# EAGLE design SparkFun RTK Facet - External Connector (EAGLE 9.6.2)
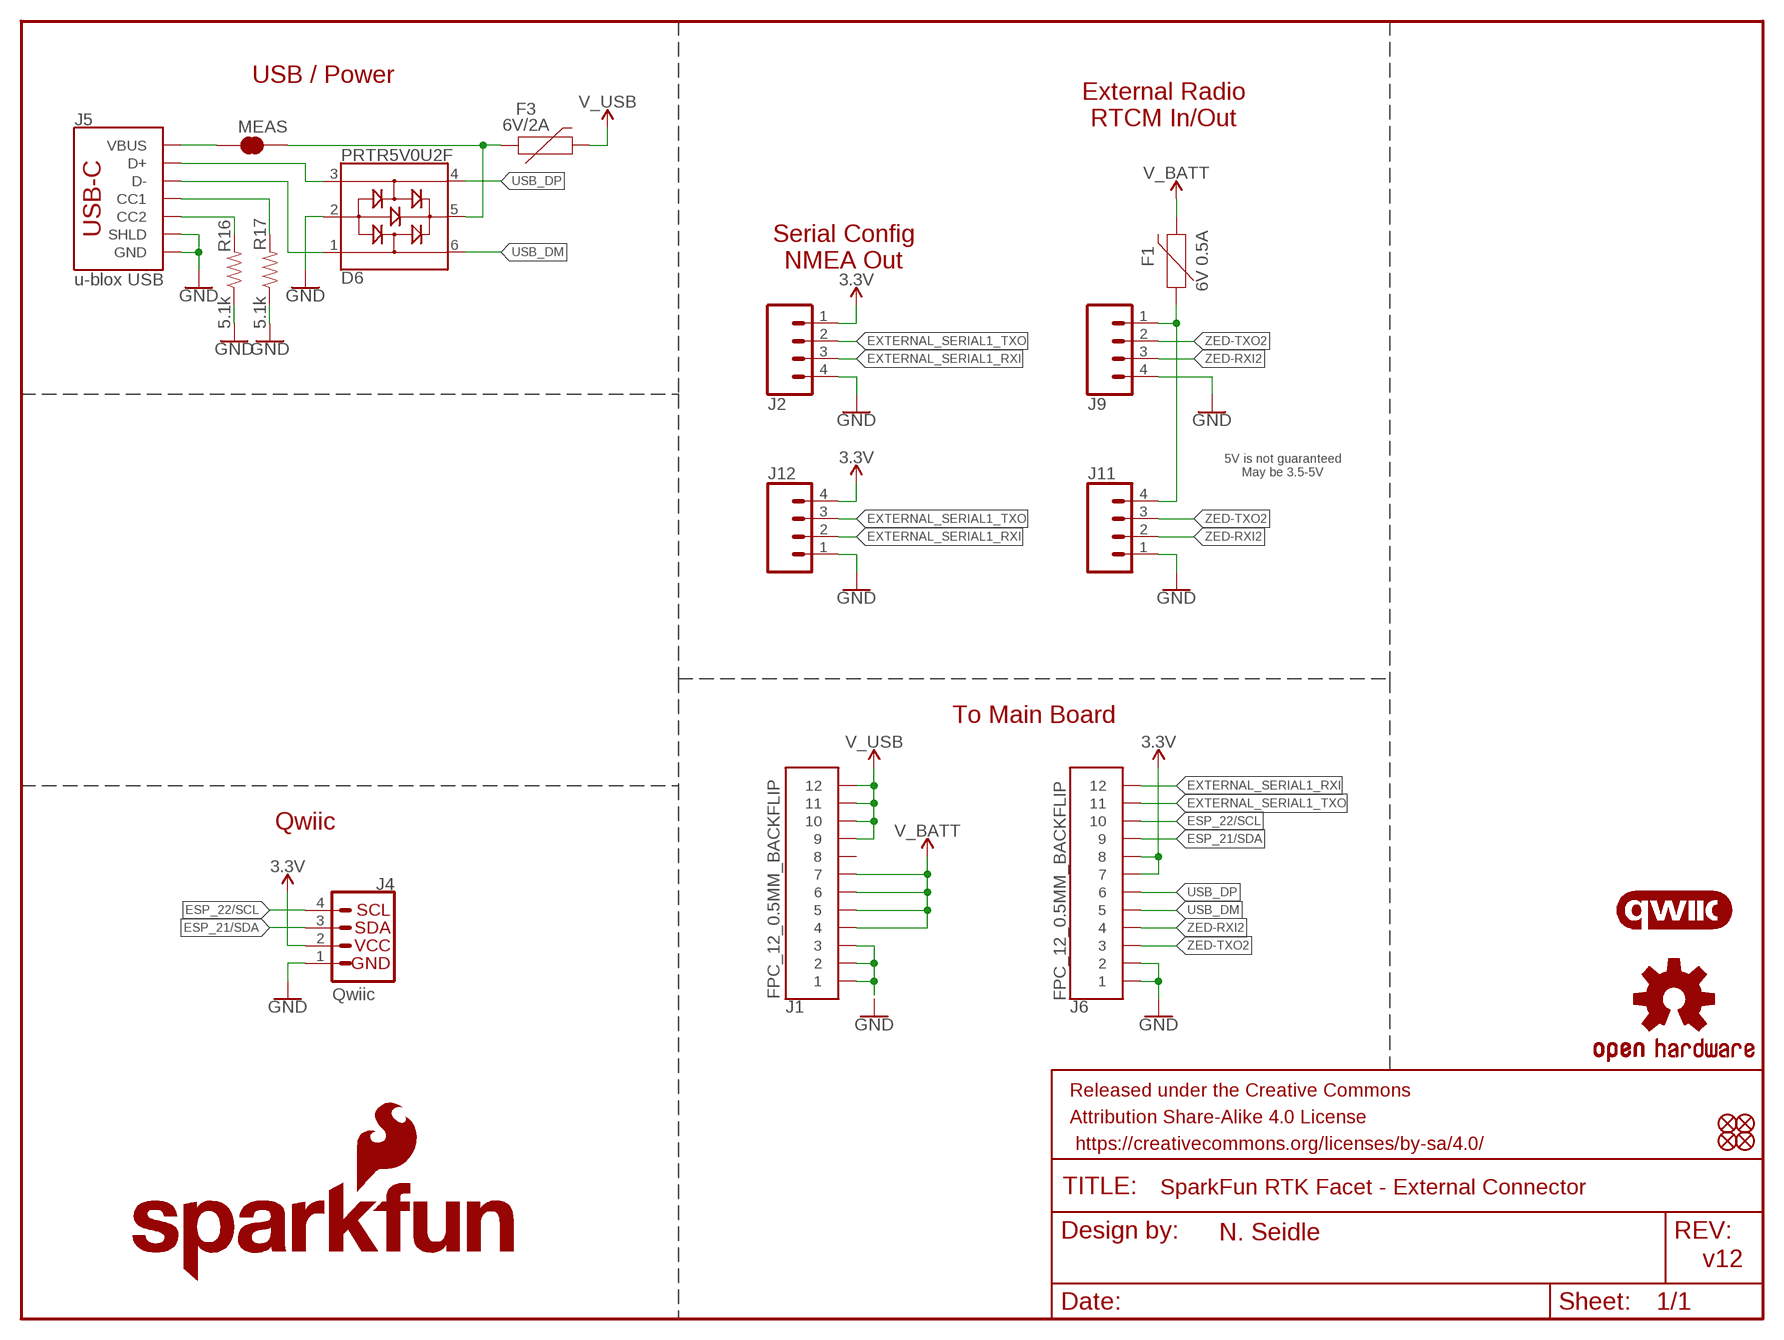
[diagram p0: schematic, sheet 1]

## Parts
D6  PRTR5V0U2F  [SOT886]
F1  6V 0.5A  PPTC_6V500MA  [0805]
F3  6V/2A  PPTC_6V2A  [1210]
FRAME1  FRAME-LETTER  [CREATIVE_COMMONS]
J1  FPC_12_0.5MM_BACKFLIP  [FPC_12_DOUBLESIDED_BACKFLIP]
J2  CONN_04JST-SMD-LOCKING  [JST-4-SMD-1.25MM-LOCKING]
J4  Qwiic  I2C_STANDARDQWIIC  [JST04_1MM_RA]
J5  u-blox USB  USB_C_2-LAYER_PADS  [USB-C-16P-2LAYER-PADS]
J6  FPC_12_0.5MM_BACKFLIP  [FPC_12_DOUBLESIDED_BACKFLIP]
J9  CONN_04JST-SMD-LOCKING  [JST-4-SMD-1.25MM-LOCKING]
J11  CONN_041X04_NO_SILK_NO_POP  [1X04_NO_SILK]
J12  CONN_041X04_NO_SILK_NO_POP  [1X04_NO_SILK]
JP21  FIDUCIALUFIDUCIAL  [FIDUCIAL-MICRO]
JP61  FIDUCIALUFIDUCIAL  [FIDUCIAL-MICRO]
JP71  FIDUCIALUFIDUCIAL  [FIDUCIAL-MICRO]
JP81  FIDUCIALUFIDUCIAL  [FIDUCIAL-MICRO]
LOGO1  OSHW-LOGOMINI  [OSHW-LOGO-MINI]
LOGO2  SFE_LOGO_NAME_FLAME.1_INCH  [SFE_LOGO_NAME_FLAME_.1]
LOGO3  QWIIC_LOGO_CONNECTOR  [QWIIC_5.5MM]
MEAS  JUMPER-COMBO_2_NC_TRACE  [COMBO-JUMPER_2_NC_TRACE]
R16  5.1k  5.1KOHM5.1KOHM-0603-1/10W-1%  [0603]
R17  5.1k  5.1KOHM5.1KOHM-0603-1/10W-1%  [0603]

## Nets
3.3V [power]: J2.1 J4.2 J6.7 J6.8 J12.4
CC1: J5.A5(CC1) R17.2
CC2: J5.B5(CC2) R16.2
ESP_21/SDA: J4.3 J6.9
ESP_22/SCL: J4.4 J6.10
EXTERNAL_SERIAL1_RXI: J2.3 J6.12 J12.2
EXTERNAL_SERIAL1_TXO: J2.2 J6.11 J12.3
GND: D6.2 J1.1 J1.2 J1.3 J2.4 J4.1 J5.GND J5.GND2(GND) J5.SHLD1(SHLD) J5.SHLD2(SHLD) J5.SHLD3(SHLD) J5.SHLD4(SHLD) J6.1 J6.2 J9.4 J11.1 J12.1 R16.1 R17.1
N$3 [power]: F1.1 J9.1 J11.4
USB1_D_M: D6.1 J5.A7(D-) J5.B7(D-)
USB1_D_P: D6.3 J5.A6(D+) J5.B6(D+)
USB_DM: D6.6 J6.5
USB_DP: D6.4 J6.6
V_BATT [power]: F1.2 J1.4 J1.5 J1.6 J1.7
V_USB [power]: F3.2 J1.9 J1.10 J1.11 J1.12
VIN [power]: J5.VBUS1(VBUS) J5.VBUS2(VBUS) MEAS.1 MEAS.3
VIN1 [power]: D6.5 F3.1 MEAS.2 MEAS.4
ZED-RXI2: J6.4 J9.3 J11.2
ZED-TXO2: J6.3 J9.2 J11.3
Unconnected: J1.8

## Notes on the sheet
- USB / Power
- External Radio
  RTCM In/Out
- Serial Config
  NMEA Out
- 5V is not guaranteed
  May be 3.5-5V
- To Main Board
- Qwiic
- N. Seidle
- v12

## Library data of the parts
D6 = SparkFun-IC-Power:PRTR5V0U2: A small ESD protection device. Most commonly used on USB D+/D- signals to protect large, expensive, or especially sensitive USB enabled devices.; PROD_ID: DIO-14084
F1 = SparkFun-Fuses:PPTC: Resettable Fuse PPTC Resettable Fuse. Really a sort of resistor with a polymeric positive temperature coefficient whose resistance increases dramatically with an increase in temperature. When heated by the power passing through the resistance rises causing the current to be limited, protecting the circuit. This is achieved by the transition of the polymer from a crystalline to an amorphous state where the conductive carbon separates breaking the conductive pathways found in the cool crystalline structure. When a PPTC cools back down it resumes conducting letting the circuit turn back on. SparkFun Products: SparkFun RedBoard - Programmed with Arduino <https://www.sparkfun.com/products/12757> Pro Micro - 5V/16MHz <https://www.sparkfun.com/products/12640> Arduino Pro 328 - 5V/16MHz <https://www.sparkfun.com/products/10915> MP3 Trigger <https://www.sparkfun.com/products/13720>; PROD_ID: RES-13945
F3 = SparkFun-Fuses:PPTC: Resettable Fuse PPTC Resettable Fuse. Really a sort of resistor with a polymeric positive temperature coefficient whose resistance increases dramatically with an increase in temperature. When heated by the power passing through the resistance rises causing the current to be limited, protecting the circuit. This is achieved by the transition of the polymer from a crystalline to an amorphous state where the conductive carbon separates breaking the conductive pathways found in the cool crystalline structure. When a PPTC cools back down it resumes conducting letting the circuit turn back on. SparkFun Products: SparkFun RedBoard - Programmed with Arduino <https://www.sparkfun.com/products/12757> Pro Micro - 5V/16MHz <https://www.sparkfun.com/products/12640> Arduino Pro 328 - 5V/16MHz <https://www.sparkfun.com/products/10915> MP3 Trigger <https://www.sparkfun.com/products/13720>; PROD_ID: RES-14313
FRAME1 = SparkFun-Aesthetics:FRAME-LETTER: Schematic Frame - Letter Standard 8.5x11 US Letter frame
J1 J6 = RTK Facet:FPC_12_0.5MM; PROD_ID: CONN-15766
J2 J9 = SparkFun-Connectors:CONN_04: Multi connection point. Often used as Generic Header-pin footprint for 0.1 inch spaced/style header connections On any of the 0.1 inch spaced packages, you can populate with these: Break Away Headers - Straight <https://www.sparkfun.com/products/116> (PRT-00116) Break Away Male Headers - Right Angle <https://www.sparkfun.com/products/553> (PRT-00553) Female Headers <https://www.sparkfun.com/products/115> (PRT-00115) Break Away Headers - Machine Pin <https://www.sparkfun.com/products/117> (PRT-00117) Break Away Female Headers - Swiss Machine Pin <https://www.sparkfun.com/products/743> (PRT-00743) For SCREWTERMINALS and SPRING TERMINALS visit here: Screw Terimnals on SparkFun.com <https://www.sparkfun.com/search/results?term=Screw+Terminals> (5mm/3.5mm/2.54mm spacing) This device is also useful as a general connection point to wire up your design to another part of your project. Our various solder wires solder well into these plated through hole pads. Hook-Up Wire - Assortment (Stranded, 22 AWG) <https://www.sparkfun.com/products/11375> (PRT-11375) Hook-Up Wire - Assortment (Solid Core, 22 AWG) <https://www.sparkfun.com/products/11367> (PRT-11367) View the entire wire category on our website here <https://www.sparkfun.com/categories/141> Special notes: Molex polarized connector foot print use with SKU : PRT-08231 with associated crimp pins and housings. 1MM SMD Version SKU: PRT-10208; PROD_ID: CONN-15303
J4 = SparkFun-Connectors:I2C_STANDARD: SparkFun I2C Standard Pinout Header SparkFun has standardized on a pinout for all I2C based sensor breakouts. This pinout allows I2C boards to be plugged directly into the headers on Arduino Uno compatible boards, and to be daisy chained easily. Example SparkFun Products: SparkFun Atmospheric Sensor Breakout - BME280 <https://www.sparkfun.com/products/13676> SparkFun Altitude/Pressure Sensor Breakout - MPL3115A2 <https://www.sparkfun.com/products/11084> SparkFun TOF Range Finder Sensor - VL6180 <https://www.sparkfun.com/products/12785>; PROD_ID: CONN-13694; VALUE: Qwiic Right Angle
J5 = SparkFun-Connectors:USB_C: USB Type C 16Pin Connector Super Speed pins not available on the 16-pin purely SMD connector so this part is best for USB 2.0 implementations. D1 and D2 are tied together enabling D+/- no matter which way the cable is plugged into the connector. The two channel configuration pins (CC1/2) are exposed. These are normally connected to ground via 5.1k resistors but can be reconfigured for high current/high power applications. **4-LAYER BOARD WARNING!!** If designing 4-layer board, make sure to select the variant _4-LAYER-ISOLATED. The linked footprint (USB-C-16-4LAYER-ISOLATED) includes some very necessary cutout polygons in the inner layers (2 and 15). This prevents the PTH mounting shield legs on the USB connector from electrically connecting any other polygons on the inner layers (usually VCC and GND).; PROD_ID: CONN-14122
J11 J12 = SparkFun-Connectors:CONN_04: Multi connection point. Often used as Generic Header-pin footprint for 0.1 inch spaced/style header connections On any of the 0.1 inch spaced packages, you can populate with these: Break Away Headers - Straight <https://www.sparkfun.com/products/116> (PRT-00116) Break Away Male Headers - Right Angle <https://www.sparkfun.com/products/553> (PRT-00553) Female Headers <https://www.sparkfun.com/products/115> (PRT-00115) Break Away Headers - Machine Pin <https://www.sparkfun.com/products/117> (PRT-00117) Break Away Female Headers - Swiss Machine Pin <https://www.sparkfun.com/products/743> (PRT-00743) For SCREWTERMINALS and SPRING TERMINALS visit here: Screw Terimnals on SparkFun.com <https://www.sparkfun.com/search/results?term=Screw+Terminals> (5mm/3.5mm/2.54mm spacing) This device is also useful as a general connection point to wire up your design to another part of your project. Our various solder wires solder well into these plated through hole pads. Hook-Up Wire - Assortment (Stranded, 22 AWG) <https://www.sparkfun.com/products/11375> (PRT-11375) Hook-Up Wire - Assortment (Solid Core, 22 AWG) <https://www.sparkfun.com/products/11367> (PRT-11367) View the entire wire category on our website here <https://www.sparkfun.com/categories/141> Special notes: Molex polarized connector foot print use with SKU : PRT-08231 with associated crimp pins and housings. 1MM SMD Version SKU: PRT-10208
JP21 JP61 JP71 JP81 = SparkFun-Aesthetics:FIDUCIAL: Fiducial Alignment Points Point-of-reference for pick-and-place machines and other optical instruments.
LOGO1 = SparkFun-Aesthetics:OSHW-LOGO: Open-Source Hardware (OSHW) Logo This logo indicates the piece of hardware it is found on incorporates a OSHW license and/or adheres to the definition of open source hardware found here: http://freedomdefined.org/OSHW
LOGO2 = SparkFun-Aesthetics:SFE_LOGO_NAME_FLAME: SparkFun Font Logo w/ Flame This is the SparkFun full logo. The logo on the schematic will always be the same size; the package variant is the height of the flame part of the logo. Default layer for the logo on the board is tSilk.
LOGO3 = SparkFun-Aesthetics:QWIIC_LOGO: Qwiic Logos for placement on schematic and PCB. The 5.5mm silk logo is best for placing next to Qwiic connector.
MEAS = SparkFun-Jumpers:JUMPER-COMBO_2_NC_TRACE
R16 R17 = SparkFun-Resistors:5.1KOHM; PROD_ID: RES-12083

## Net classes
1 power: width 0.305 mm
2 3.3V: width 0.305 mm
3 RF: width 0.35 mm, clearance 0.203 mm

## Board
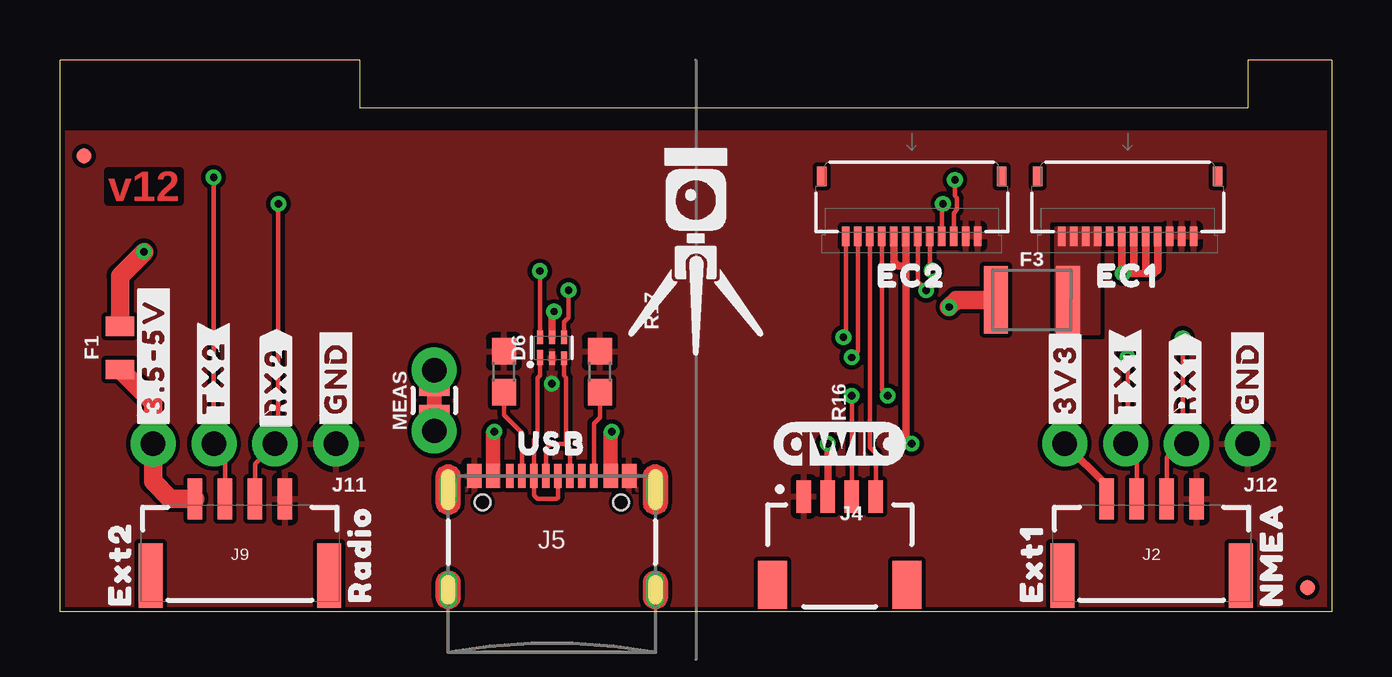
[diagram p1: board, top side]
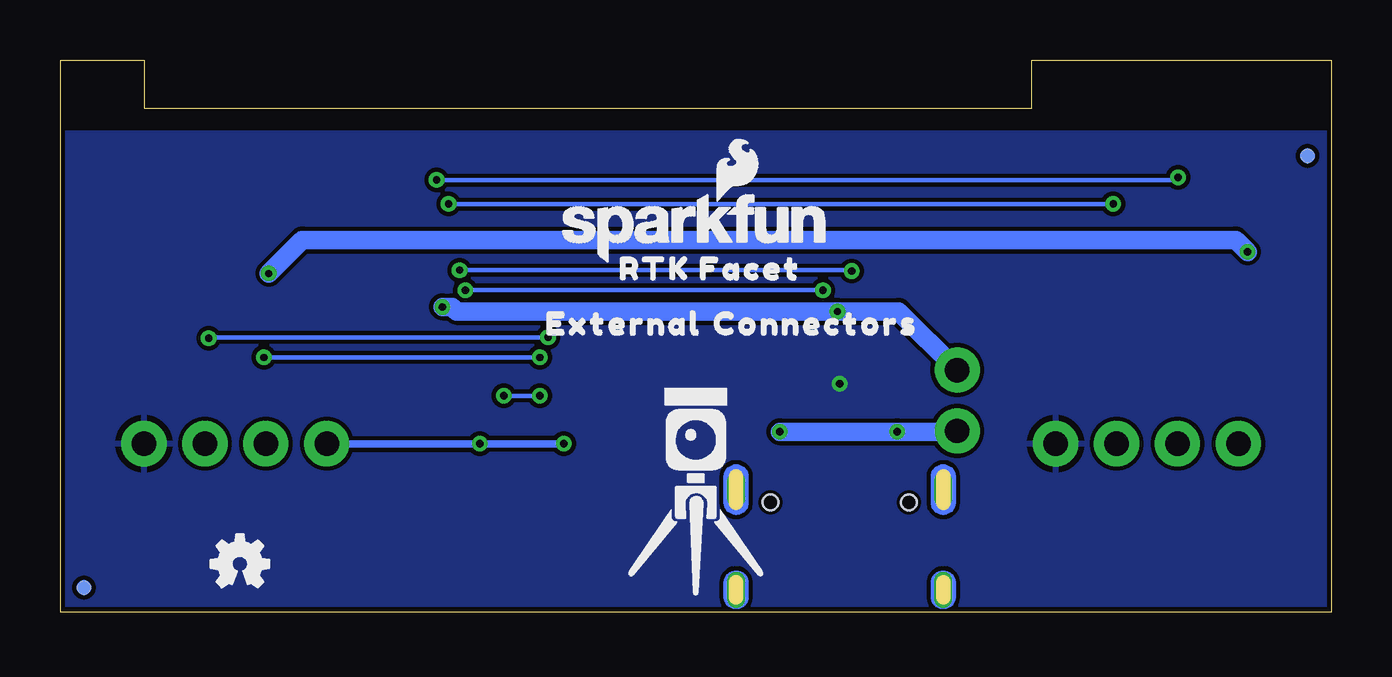
[diagram p2: board, bottom side, seen from below]

Size 53 x 23 mm. Coordinates in mm from the lower left corner, seen from the top.
Outline: 53,23 53,0 0,0 0,23 12.5,23 12.5,21 49.5,21 49.5,23 53,23
Copper layers (1*16): Top 0.035mm / dielectric 1.5mm / Bottom 0.035mm
Design rules "SparkFun-2-Layer-General-JLCPCB": minimum track width 7mil, minimum drill 0.3mm, track to track 7mil, track to pad 7mil, pad to pad 7mil, via to via 7mil, smd to smd 7mil, copper to edge 7mil, drill to drill 7mil, minimum pad ring 7mil, minimum via ring 7mil, stop-mask expansion 4mil, vias tented up to drill 25mil, thermal gap 10mil
tKeepout: area 0,0 to 2,20
bKeepout: area 47.5,0 to 49.5,20; area 0,0 to 2,20

### Footprints (pad centres in the part's own frame; a part is rotated, then mirrored left to right if it is on the bottom)
SOT886 = smd 0.61 x 0.25: 1 -0.405,0.5 | smd 0.56 x 0.25: 2 -0.43,0; 3 -0.43,-0.5; 4 0.43,-0.5; 5 0.43,0; 6 0.43,0.5
0805 = smd 0.8 x 1.2: 1 -0.9,0; 2 0.9,0
1210 = smd 1 x 2.8: 1 -1.5,0; 2 1.5,0
FPC_12_DOUBLESIDED_BACKFLIP = smd 0.3 x 0.8: 1 -2.75,1.35; 2 -2.25,1.35; 3 -1.75,1.35; 4 -1.25,1.35; 5 -0.75,1.35; 6 -0.25,1.35; 7 0.25,1.35; 8 0.75,1.35; 9 1.25,1.35; 10 1.75,1.35; 11 2.25,1.35; 12 2.75,1.35 | smd 0.4 x 0.8: MP1 -3.75,-1.15; MP2 3.75,-1.15
JST-4-SMD-1.25MM-LOCKING = smd 0.6 x 1.7: 1 -1.875,3.3; 2 -0.625,3.3; 3 0.625,3.3; 4 1.875,3.3 | smd 1 x 2.7: NC1 3.725,0.1; NC2 -3.725,0.1
JST04_1MM_RA = smd 0.6 x 1.35: 1 -1.5,0; 2 -0.5,0; 3 0.5,0; 4 1.5,0 | smd 1.2 x 2: NC1 2.8,-3.675; NC2 -2.8,-3.675
USB-C-16P-2LAYER-PADS = smd 0.3 x 1: A5 -1.25,-0.34; A6 -0.25,-0.34; A7 0.25,-0.34; A8 1.25,-0.34; B5 1.75,-0.34; B6 0.75,-0.34; B7 -0.75,-0.34; B8 -1.75,-0.34 | smd 0.6 x 1: GND -3.225,-0.34; GND2 3.225,-0.34; VBUS1 -2.45,-0.34; VBUS2 2.45,-0.34 | drill 0.4 pad 0.6 long: SHLD1 -4.318,-0.915; SHLD2 4.318,-0.915; SHLD3 -4.318,-5.095; SHLD4 4.318,-5.095 | hole 0.65: -2.89,-1.445; 2.89,-1.445
1X04_NO_SILK = drill 1.016 pad 1.88: 1 0,0; 2 2.54,0; 3 5.08,0; 4 7.62,0
FIDUCIAL-MICRO = smd 0.635 x 0.635: 1 0,0
COMBO-JUMPER_2_NC_TRACE = smd 0.635 x 1.27: 1 -0.508,0; 2 0.508,0 | drill 1.016 pad 1.88: 3 -1.27,0; 4 1.27,0
0603 = smd 1.1 x 1: 1 -0.85,0; 2 0.85,0

### Placement (x,y rotation side)
D6  20.5,11 90 top
F1  2.5,11 90 top
F3  40.5,13 0 top
FRAME1  21.59,-10.16 0 top  (outside the outline)
J1  44.5,17 180 top
J2  45.5,1.4 0 top
J4  32.5,4.8 0 top
J5  20.5,6 0 top
J6  35.5,17 180 top
J9  7.5,1.4 0 top
J11  11.5,7 180 top
J12  49.5,7 180 top
JP21  52,1 0 top
JP61  1,19 0 top
JP71  52,1 0 bottom
JP81  1,19 0 bottom
LOGO1  45.5,2 0 bottom
LOGO2  26.5,16 0 bottom
LOGO3  32.5,7 0 top
MEAS  15.6,8.8 90 top
R16  22.5,10 270 top
R17  18.5,10 270 top
U$1  [USB0]  20.5,7 0 top
U$2  [CONNECTORS1]  21.5,12 0 bottom
U$3  [RTK5#SVG0]  26.5,15 0 top
U$4  [EXT10]  40.5,2 90 top
U$5  [#3V3#0]  41.9,7.5 90 top
U$6  [EXT22]  2.5,2 90 top
U$7  [NMEA1]  50.5,2.4 90 top
U$8  [EC10]  44.5,14 0 top
U$9  [EXTERNAL0]  29.5,12 0 bottom
U$11  [EC21]  35.5,14 0 top
U$12  [RADIO3]  12.5,2.4 90 top
U$13  [RTK5#SVG0]  26.5,5 0 bottom
U$14  [RTK_FACET0]  25.9,14.3 0 bottom
U$23  [#3#5#5V#0]  3.9,7.5 90 top
U$38  [#GND#0]  11.5,7.5 90 top
U$39  [#RX2#2]  9,7.4 90 top
U$40  [#TX2#1]  6.4,7.5 90 top
U$65  [#TX1#1]  44.4,7.5 90 top
U$68  [#RX1#2]  46.9,7.5 90 top
U$82  [#GND#0]  49.5,7.5 90 top

### Tracks (layer width: path | path; a pad name or v marks a point on that pad's centre or on a via)
3.3V  (via drill 0.3)
  Top 0.305: J6.7 35.25,14.4 | 35.25,14.4 35.25,7.25 v35.5,7 | J4.2 v32,7 | J6.8 34.75,14.6 34.95,14.4 35.25,14.4 | J2.1 43.62,5.25 J12.4
  Bottom 0.305: v32,7 v35.5,7 J12.4
CC1
  Top 0.178: J5.A5 19.25,7.45 18.5,8.2 R17.2
CC2
  Top 0.178: J5.B5 22.25,7.85 22.5,8.1 R16.2
ESP_21/SDA  (via drill 0.3)
  Top 0.178: J6.9 34.25,9.25 v34.5,9 | J4.3 v33,9
  Bottom 0.178: v33,9 v34.5,9
ESP_22/SCL
  Top 0.178: J6.10 33.75,6.85 34,6.6 J4.4
EXTERNAL_SERIAL1_RXI  (via drill 0.3)
  Top 0.178: J6.12 32.75,11.53 v32.66,11.43 | v46.8,11.4 46.8,7.16 46.83,7.13 | 46.83,7.13 J12.2 | J2.3 46.12,6.42 46.83,7.13
  Bottom 0.178: v32.66,11.43 46.77,11.43 v46.8,11.4
EXTERNAL_SERIAL1_TXO  (via drill 0.3)
  Top 0.178: J6.11 33.25,10.85 v33,10.6 | v44.5,10.6 44.5,7.08 J12.3 44.88,6.54 J2.2
  Bottom 0.178: v33,10.6 v44.5,10.6
GND  (via drill 0.3)
  other vias: 20.5,9.5
  pour Top (isolate 0.152, rank 4): 0,20 53,20 53,0 0,0
  pour Bottom (isolate 0.152, rank 4): 0,20 53,20 53,0 0,0
N$3
  Top 0.762: F1.1 3.88,8.72 J11.4 3.88,5.42 4.6,4.7 J9.1
USB1_D_M
  Top 0.178: J5.A7 20.75,4.75 20.7,4.7 19.9,4.7 19.75,4.85 J5.B7 19.75,7.15 19.91,7.31 19.91,9.75 20,9.84 D6.1
USB1_D_P
  Top 0.178: J5.A6 20.25,6.8 20.45,7 21.05,7 21.09,6.96 | J5.B6 21.25,6.8 21.09,6.96 | D6.3 21,9.84 21.09,9.75 21.09,6.96
USB_DM  (via drill 0.3)
  Top 0.178: J6.5 36.25,14.33 v36.34,14.23 | v20,14.2 D6.6
  Bottom 0.178: v36.34,14.23 20.03,14.23 v20,14.2
USB_DP  (via drill 0.3)
  Top 0.178: v36.1,13.4 35.75,13.75 J6.6 | D6.4 21,12.08 21.19,12.27 21.19,13.39 v21.2,13.4
  Bottom 0.178: v21.2,13.4 v36.1,13.4
V_BATT  (via drill 0.3)
  Top 0.305: J1.7 44.25,14.15 v44.3,14.1 44.8,14.1 | J1.4 45.75,14.25 45.6,14.1 45.3,14.1 | 45.3,14.1 44.8,14.1 | J1.5 45.25,14.15 45.3,14.1 | J1.6 44.75,14.15 44.8,14.1
  Top 0.762: v3.5,15 2.5,14 F1.2
  Bottom 0.762: v44.3,14.1 42.9,15.5 4,15.5 v3.5,15
V_USB
  pour Top (isolate 0.152, no thermals): 41.5,16 43.3,16 43.3,11.6 41.5,11.6
VIN  (via drill 0.3)
  Top 0.305: MEAS.1 MEAS.3
  Top 0.559: 18.05,7.45 v18.1,7.5 | 22.95,7.45 v23,7.5
  Top 0.61: J5.VBUS1 18.05,7.45 | J5.VBUS2 22.95,7.45
  Bottom 0.559: 15.63,7.5 MEAS.3
  Bottom 0.762: 15.63,7.5 v18.1,7.5 v23,7.5
VIN1  (via drill 0.3)
  Top 0.305: D6.5 20.5,12.42 v20.59,12.51 | MEAS.2 MEAS.4
  Top 0.762: F3.1 37.36,13 v37.06,12.7
  Bottom 0.762: v37.06,12.7 36.65,12.7 36.47,12.51 v20.59,12.51 18.04,12.51 MEAS.4
ZED-RXI2  (via drill 0.3)
  Top 0.178: J6.4 36.75,16.95 v36.8,17 | v9.1,17 9.1,7.14 J11.2 8.12,6.17 J9.3
  Bottom 0.178: v36.8,17 v9.1,17
ZED-TXO2  (via drill 0.3)
  Top 0.178: J6.3 37.25,16.61 37.4,16.75 37.4,17.25 37.3,17.34 v37.3,18 | v6.4,18.1 6.4,7.02 J11.3 6.88,6.54 J9.2
  Bottom 0.178: v37.3,18 6.5,18 v6.4,18.1

### Text on the board
Top: v12
tDocu: Board thickness is 1.6mm | N. Seidle